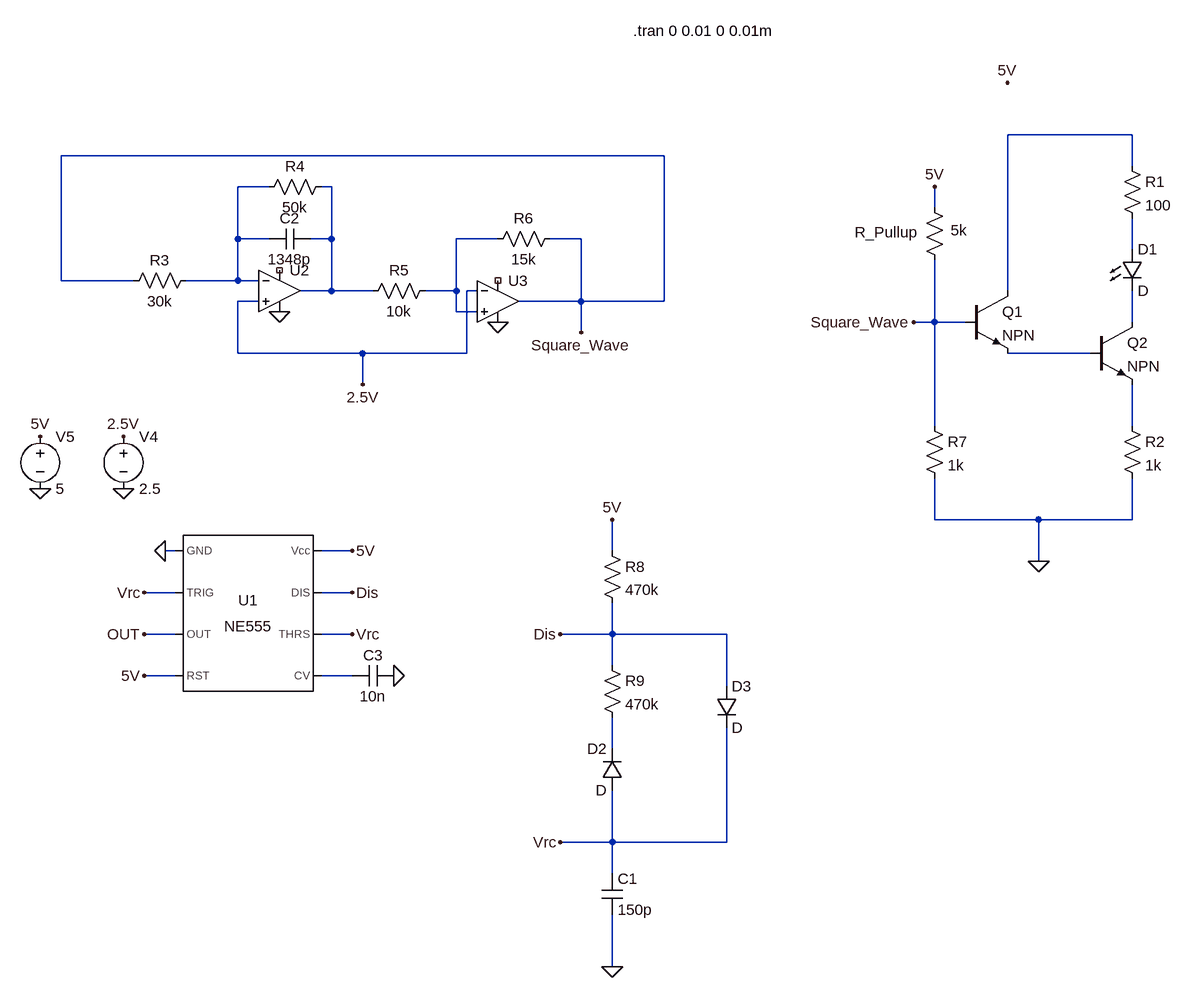
[diagram p0: schematic Transmitter_Simulation.asc]
Transmitter_Simulation.asc, the LTspice schematic file:
Version 4.1
SHEET 1 3044 1748
WIRE 1456 448 1264 448
WIRE 736 480 -192 480
WIRE 1456 496 1456 448
WIRE 128 528 80 528
WIRE 224 528 208 528
WIRE 1152 560 1152 528
WIRE 80 608 80 528
WIRE 128 608 80 608
WIRE 224 608 224 528
WIRE 224 608 192 608
WIRE 480 608 416 608
WIRE 608 608 560 608
WIRE 1456 624 1456 576
WIRE -192 672 -192 480
WIRE -80 672 -192 672
WIRE 80 672 80 608
WIRE 80 672 0 672
WIRE 112 672 80 672
WIRE 224 688 224 608
WIRE 224 688 176 688
WIRE 288 688 224 688
WIRE 416 688 416 608
WIRE 416 688 368 688
WIRE 448 688 432 688
WIRE 1264 688 1264 448
WIRE 112 704 80 704
WIRE 608 704 608 608
WIRE 608 704 512 704
WIRE 736 704 736 480
WIRE 736 704 608 704
WIRE 416 720 416 688
WIRE 448 720 416 720
WIRE 1152 736 1152 640
WIRE 1152 736 1120 736
WIRE 1200 736 1152 736
WIRE 1456 736 1456 688
WIRE 608 752 608 704
WIRE 80 784 80 704
WIRE 272 784 80 784
WIRE 432 784 432 688
WIRE 432 784 272 784
WIRE 1392 784 1264 784
WIRE 272 832 272 784
WIRE 1152 896 1152 736
WIRE 1456 896 1456 832
WIRE 1152 1040 1152 976
WIRE 1312 1040 1152 1040
WIRE 1456 1040 1456 976
WIRE 1456 1040 1312 1040
WIRE -16 1088 -32 1088
WIRE 256 1088 208 1088
WIRE 656 1088 656 1040
WIRE 1312 1104 1312 1040
WIRE -16 1152 -64 1152
WIRE 256 1152 208 1152
WIRE -16 1216 -64 1216
WIRE 256 1216 208 1216
WIRE 656 1216 656 1168
WIRE 656 1216 576 1216
WIRE 832 1216 656 1216
WIRE 656 1264 656 1216
WIRE -16 1280 -64 1280
WIRE 256 1280 208 1280
WIRE 832 1296 832 1216
WIRE 656 1392 656 1344
WIRE 656 1536 656 1456
WIRE 656 1536 576 1536
WIRE 832 1536 832 1360
WIRE 832 1536 656 1536
WIRE 656 1584 656 1536
WIRE 656 1728 656 1648
FLAG -96 912 2.5V
FLAG 272 832 2.5V
FLAG -224 912 5V
FLAG 480 736 0
FLAG 144 720 0
FLAG -96 992 0
FLAG -224 992 0
FLAG 608 752 Square_Wave
FLAG 1120 736 Square_Wave
FLAG 1152 528 5V
FLAG 1264 368 5V
FLAG 1312 1104 0
FLAG -32 1088 0
FLAG 656 1728 0
FLAG -64 1152 Vrc
FLAG 256 1216 Vrc
FLAG 576 1536 Vrc
FLAG 576 1216 Dis
FLAG 256 1152 Dis
FLAG -64 1216 OUT
FLAG -64 1280 5V
FLAG 320 1280 0
FLAG 656 1040 5V
FLAG 256 1088 5V
SYMBOL OpAmps\\UniversalOpAmp2 144 688 R0
SYMATTR InstName U2
SYMBOL OpAmps\\UniversalOpAmp2 480 704 R0
SYMATTR InstName U3
SYMBOL res 16 656 R90
WINDOW 0 0 56 VBottom 2
WINDOW 3 32 56 VTop 2
SYMATTR InstName R3
SYMATTR Value 30k
SYMBOL res 224 512 R90
WINDOW 0 0 56 VBottom 2
WINDOW 3 32 56 VTop 2
SYMATTR InstName R4
SYMATTR Value 50k
SYMBOL cap 192 592 R90
WINDOW 0 0 32 VBottom 2
WINDOW 3 32 32 VTop 2
SYMATTR InstName C2
SYMATTR Value 1348p
SYMBOL res 384 672 R90
WINDOW 0 0 56 VBottom 2
WINDOW 3 32 56 VTop 2
SYMATTR InstName R5
SYMATTR Value 10k
SYMBOL res 576 592 R90
WINDOW 0 0 56 VBottom 2
WINDOW 3 32 56 VTop 2
SYMATTR InstName R6
SYMATTR Value 15k
SYMBOL voltage -96 896 R0
WINDOW 123 0 0 Left 0
WINDOW 39 0 0 Left 0
SYMATTR InstName V4
SYMATTR Value 2.5
SYMBOL voltage -224 896 R0
WINDOW 123 0 0 Left 0
WINDOW 39 0 0 Left 0
SYMATTR InstName V5
SYMATTR Value 5
SYMBOL LED 1440 624 R0
SYMATTR InstName D1
SYMBOL npn2 1200 688 R0
SYMATTR InstName Q1
SYMBOL npn2 1392 736 R0
SYMATTR InstName Q2
SYMBOL res 1136 544 R0
WINDOW 0 -107 54 Left 2
WINDOW 3 41 51 Left 2
SYMATTR InstName R_Pullup
SYMATTR Value 5k
SYMBOL res 1440 480 R0
SYMATTR InstName R1
SYMATTR Value 100
SYMBOL res 1440 880 R0
SYMATTR InstName R2
SYMATTR Value 1k
SYMBOL res 1136 880 R0
SYMATTR InstName R7
SYMATTR Value 1k
SYMBOL Misc\\NE555 96 1184 R0
SYMATTR InstName U1
SYMBOL res 640 1072 R0
SYMATTR InstName R8
SYMATTR Value 470k
SYMBOL res 640 1248 R0
SYMATTR InstName R9
SYMATTR Value 470k
SYMBOL diode 672 1456 R180
WINDOW 0 24 64 Left 2
WINDOW 3 24 0 Left 2
SYMATTR InstName D2
SYMBOL diode 816 1296 R0
SYMATTR InstName D3
SYMBOL cap 640 1584 R0
SYMATTR InstName C1
SYMATTR Value 150p
SYMBOL cap 320 1264 R90
WINDOW 0 0 32 VBottom 2
WINDOW 3 32 32 VTop 2
SYMATTR InstName C3
SYMATTR Value 10n
TEXT 688 288 Left 2 !.tran 0 0.01 0 0.01m

The netlist it stands for:
* Transmitter_Simulation.asc
X§U2 2.5V N002 NC_01 0 N003 level2 Avol=1Meg GBW=10Meg Slew=10Meg Ilimit=25m Rail=0 Vos=0 En=0 Enk=0 In=0 Ink=0 Rin=500Meg  ; pins In+ In- V+ V- OUT
X§U3 N004 2.5V NC_02 0 Square_Wave level2 Avol=1Meg GBW=10Meg Slew=10Meg Ilimit=25m Rail=0 Vos=0 En=0 Enk=0 In=0 Ink=0 Rin=500Meg  ; pins In+ In- V+ V- OUT
R3 N002 Square_Wave 30k
R4 N003 N002 50k
C2 N003 N002 1348p
R5 N004 N003 10k
R6 Square_Wave N004 15k
V4 2.5V 0 2.5
V5 5V 0 5
D1 N005 N006 D
Q1 N001 Square_Wave N007 0 NPN
Q2 N006 N007 N008 0 NPN
R_Pullup 5V Square_Wave 5k
R1 N001 N005 100
R2 N008 0 1k
R7 Square_Wave 0 1k
X§U1 0 Vrc OUT 5V N009 Vrc Dis 5V NE555  ; pins GND TRIG OUT RST CV THRS DIS Vcc
R8 5V Dis 470k
R9 Dis N010 470k
D2 Vrc N010 D
D3 Dis Vrc D
C1 Vrc 0 150p
C3 0 N009 10n
.model D D
.lib standard.dio
.model NPN NPN
.model PNP PNP
.lib standard.bjt
.tran 0 0.01 0 0.01m
.lib UniversalOpAmp2.lib
.lib NE555.sub
.backanno
.end